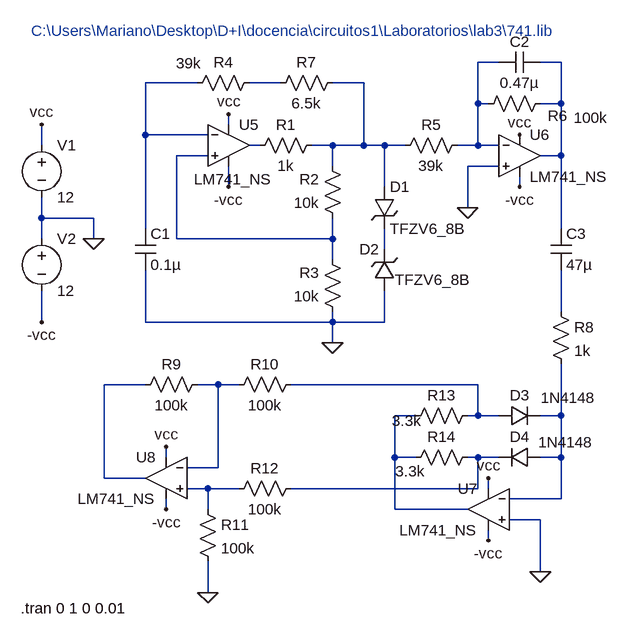
[diagram p0: schematic lab3.asc]
lab3.asc, the LTspice schematic file:
Version 4
SHEET 1 880 856
WIRE 480 0 448 0
WIRE 576 0 544 0
WIRE 16 32 -64 32
WIRE 144 32 96 32
WIRE 272 32 224 32
WIRE 448 64 448 0
WIRE 464 64 448 64
WIRE 576 64 576 0
WIRE 576 64 544 64
WIRE 64 96 64 80
WIRE -64 112 -64 32
WIRE 32 112 -64 112
WIRE -224 128 -224 96
WIRE 112 128 96 128
WIRE 224 128 192 128
WIRE 272 128 272 32
WIRE 272 128 224 128
WIRE 304 128 272 128
WIRE 336 128 304 128
WIRE 448 128 448 64
WIRE 448 128 416 128
WIRE 480 128 448 128
WIRE 32 144 -16 144
WIRE 576 144 576 64
WIRE 576 144 544 144
WIRE 224 160 224 128
WIRE 480 160 432 160
WIRE 64 192 64 160
WIRE 304 192 304 128
WIRE 512 192 512 176
WIRE 432 224 432 160
WIRE -224 240 -224 208
WIRE -144 240 -224 240
WIRE -64 256 -64 112
WIRE 576 256 576 144
WIRE -224 272 -224 240
WIRE -144 272 -144 240
WIRE -16 272 -16 144
WIRE 224 272 224 240
WIRE 224 272 -16 272
WIRE 304 288 304 256
WIRE 224 304 224 272
WIRE 576 384 576 320
WIRE -224 400 -224 352
WIRE -64 400 -64 320
WIRE 224 400 224 384
WIRE 224 400 -64 400
WIRE 304 400 304 352
WIRE 304 400 224 400
WIRE 224 432 224 400
WIRE -64 496 -128 496
WIRE 48 496 16 496
WIRE 80 496 48 496
WIRE 448 496 160 496
WIRE 352 544 320 544
WIRE 448 544 448 496
WIRE 448 544 432 544
WIRE 480 544 448 544
WIRE 576 544 576 464
WIRE 576 544 544 544
WIRE -32 608 -32 592
WIRE 320 608 320 544
WIRE 352 608 320 608
WIRE 448 608 432 608
WIRE 480 608 448 608
WIRE 576 608 576 544
WIRE 576 608 544 608
WIRE 48 624 48 496
WIRE 48 624 0 624
WIRE -128 640 -128 496
WIRE -64 640 -128 640
WIRE 32 656 0 656
WIRE 80 656 32 656
WIRE 448 656 448 608
WIRE 448 656 160 656
WIRE 464 656 464 640
WIRE 576 672 576 608
WIRE 576 672 496 672
WIRE -32 688 -32 672
WIRE 32 688 32 656
WIRE 320 688 320 608
WIRE 432 688 320 688
WIRE 544 704 496 704
WIRE 464 736 464 720
WIRE 544 784 544 704
WIRE 32 816 32 768
FLAG 224 432 0
FLAG 432 224 0
FLAG 32 816 0
FLAG 544 784 0
FLAG -144 272 0
FLAG -224 96 vcc
FLAG -224 400 -vcc
FLAG 64 192 -vcc
FLAG 64 80 vcc
FLAG 464 640 vcc
FLAG -32 592 vcc
FLAG 512 112 vcc
FLAG -32 688 -vcc
FLAG 464 736 -vcc
FLAG 512 192 -vcc
SYMBOL cap -80 256 R0
SYMATTR InstName C1
SYMATTR Value 0.1µ
SYMBOL res 208 112 R90
WINDOW 0 0 56 VBottom 2
WINDOW 3 32 56 VTop 2
SYMATTR InstName R1
SYMATTR Value 1k
SYMBOL res 240 256 R180
WINDOW 0 36 76 Left 2
WINDOW 3 36 40 Left 2
SYMATTR InstName R2
SYMATTR Value 10k
SYMBOL res 240 400 R180
WINDOW 0 36 76 Left 2
WINDOW 3 36 40 Left 2
SYMATTR InstName R3
SYMATTR Value 10k
SYMBOL res 112 16 R90
WINDOW 0 0 56 VBottom 2
WINDOW 3 -30 109 VTop 2
SYMATTR InstName R4
SYMATTR Value 39k
SYMBOL zener 288 192 R0
SYMATTR InstName D1
SYMATTR Value TFZV6_8B
SYMBOL zener 320 352 R180
WINDOW 0 24 64 Left 2
WINDOW 3 -117 17 Left 2
SYMATTR InstName D2
SYMATTR Value TFZV6_8B
SYMBOL res 432 112 R90
WINDOW 0 0 56 VBottom 2
WINDOW 3 32 56 VTop 2
SYMATTR InstName R5
SYMATTR Value 39k
SYMBOL res 560 48 R90
WINDOW 0 50 -11 VBottom 2
WINDOW 3 22 -62 VTop 2
SYMATTR InstName R6
SYMATTR Value 100k
SYMBOL cap 544 -16 R90
WINDOW 0 0 32 VBottom 2
WINDOW 3 32 32 VTop 2
SYMATTR InstName C2
SYMATTR Value 0.47µ
SYMBOL res 240 16 R90
WINDOW 0 0 56 VBottom 2
WINDOW 3 32 56 VTop 2
SYMATTR InstName R7
SYMATTR Value 6.5k
SYMBOL cap 560 256 R0
SYMATTR InstName C3
SYMATTR Value 47µ
SYMBOL res 560 368 R0
SYMATTR InstName R8
SYMATTR Value 1k
SYMBOL res 32 480 R90
WINDOW 0 0 56 VBottom 2
WINDOW 3 32 56 VTop 2
SYMATTR InstName R9
SYMATTR Value 100k
SYMBOL res 176 480 R90
WINDOW 0 0 56 VBottom 2
WINDOW 3 32 56 VTop 2
SYMATTR InstName R10
SYMATTR Value 100k
SYMBOL res 16 672 R0
SYMATTR InstName R11
SYMATTR Value 100k
SYMBOL res 176 640 R90
WINDOW 0 0 56 VBottom 2
WINDOW 3 32 56 VTop 2
SYMATTR InstName R12
SYMATTR Value 100k
SYMBOL diode 480 560 R270
WINDOW 0 32 32 VTop 2
WINDOW 3 59 107 VBottom 2
SYMATTR InstName D3
SYMATTR Value 1N4148
SYMBOL diode 544 592 R90
WINDOW 0 0 32 VBottom 2
WINDOW 3 -23 -39 VTop 2
SYMATTR InstName D4
SYMATTR Value 1N4148
SYMBOL res 448 528 R90
WINDOW 0 0 56 VBottom 2
WINDOW 3 8 110 VTop 2
SYMATTR InstName R13
SYMATTR Value 3.3k
SYMBOL res 448 592 R90
WINDOW 0 0 56 VBottom 2
WINDOW 3 22 104 VTop 2
SYMATTR InstName R14
SYMATTR Value 3.3k
SYMBOL voltage -224 112 R0
WINDOW 123 0 0 Left 0
WINDOW 39 0 0 Left 0
SYMATTR InstName V1
SYMATTR Value 12
SYMBOL voltage -224 256 R0
WINDOW 123 0 0 Left 0
WINDOW 39 0 0 Left 0
SYMATTR InstName V2
SYMATTR Value 12
SYMBOL AutoGenerated\\LM741_NS 64 64 R0
WINDOW 3 -53 116 Left 2
SYMATTR InstName U5
SYMBOL AutoGenerated\\LM741_NS 512 80 R0
SYMATTR InstName U6
SYMBOL AutoGenerated\\LM741_NS 464 624 M0
SYMATTR InstName U7
SYMBOL AutoGenerated\\LM741_NS -32 576 M0
SYMATTR InstName U8
TEXT -256 840 Left 2 !.tran 0 1 0 0.01
TEXT -240 -48 Left 2 ;C:\\Users\\Mariano\\Desktop\\D+I\\docencia\\circuitos1\\Laboratorios\\lab3\\741.lib

The netlist it stands for:
* lab3.asc
C1 N003 0 0.1µ
R1 N005 N006 1k
R2 N007 N005 10k
R3 0 N007 10k
R4 N004 N003 39k
D1 N005 N008 TFZV6_8B
D2 0 N008 TFZV6_8B
R5 N001 N005 39k
R6 N002 N001 100k
C2 N002 N001 0.47µ
R7 N005 N004 6.5k
C3 N002 N009 47µ
R8 N009 N014 1k
R9 N011 N010 100k
R10 N012 N011 100k
R11 N016 0 100k
R12 N015 N016 100k
D3 N012 N014 1N4148
D4 N014 N015 1N4148
R13 N012 N013 3.3k
R14 N015 N013 3.3k
V1 vcc 0 12
V2 0 -vcc 12
* U5: LM741_NS (symbol AutoGenerated\LM741_NS not available, pins judged from their places): In+=N007 In-=N003 V+=vcc V-=-vcc OUT=N006
* U6: LM741_NS (symbol AutoGenerated\LM741_NS not available, pins judged from their places): In+=0 In-=N001 V+=vcc V-=-vcc OUT=N002
* U7: LM741_NS (symbol AutoGenerated\LM741_NS not available, pins judged from their places): In+=0 In-=N014 V+=vcc V-=-vcc OUT=N013
* U8: LM741_NS (symbol AutoGenerated\LM741_NS not available, pins judged from their places): In+=N016 In-=N011 V+=vcc V-=-vcc OUT=N010
.model D D
.lib standard.dio
.tran 0 1 0 0.01
* C:\Users\Mariano\Desktop\D+I\docencia\circuitos1\Laboratorios\lab3\741.lib
.backanno
.end